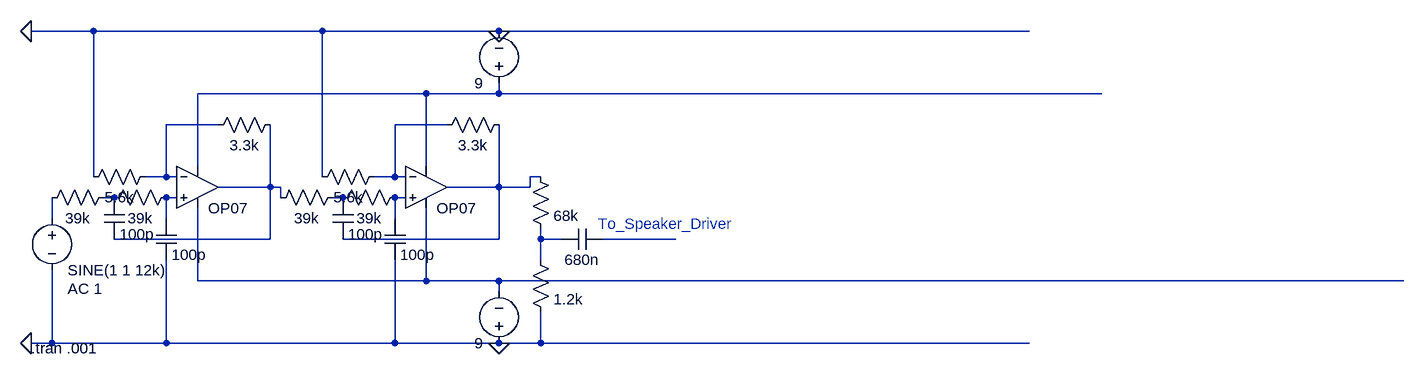
[diagram p0: schematic Transmit_Line_Final.asc]
Transmit_Line_Final.asc, the LTspice schematic file:
Version 4
SHEET 1 1620 680
WIRE -400 -80 -496 -80
WIRE -48 -80 -400 -80
WIRE 224 -80 -48 -80
WIRE 1040 -80 224 -80
WIRE 112 16 -240 16
WIRE 224 16 224 0
WIRE 224 16 112 16
WIRE 1152 16 224 16
WIRE -208 64 -288 64
WIRE 144 64 64 64
WIRE -240 128 -240 16
WIRE 112 128 112 16
WIRE -400 144 -400 -80
WIRE -288 144 -288 64
WIRE -288 144 -320 144
WIRE -272 144 -288 144
WIRE -48 144 -48 -80
WIRE 64 144 64 64
WIRE 64 144 32 144
WIRE 80 144 64 144
WIRE 288 144 272 144
WIRE -128 160 -128 64
WIRE -128 160 -208 160
WIRE -112 160 -128 160
WIRE 224 160 224 64
WIRE 224 160 144 160
WIRE 272 160 272 144
WIRE 272 160 224 160
WIRE -368 176 -384 176
WIRE -272 176 -288 176
WIRE -112 176 -112 160
WIRE -16 176 -32 176
WIRE 80 176 64 176
WIRE -464 208 -464 176
WIRE -288 208 -288 176
WIRE 64 208 64 176
WIRE -128 240 -128 160
WIRE -128 240 -368 240
WIRE 224 240 224 160
WIRE 224 240 -16 240
WIRE 288 240 288 224
WIRE 320 240 288 240
WIRE 496 240 384 240
WIRE 288 272 288 240
WIRE -240 304 -240 192
WIRE 112 304 112 192
WIRE 112 304 -240 304
WIRE 224 304 112 304
WIRE 1616 304 224 304
WIRE 224 320 224 304
WIRE -464 400 -464 288
WIRE -464 400 -496 400
WIRE -288 400 -288 272
WIRE -288 400 -464 400
WIRE 64 400 64 272
WIRE 64 400 -288 400
WIRE 224 400 64 400
WIRE 288 400 288 352
WIRE 288 400 224 400
WIRE 1040 400 288 400
FLAG 224 400 0
FLAG 224 -80 0
FLAG -496 -80 0
FLAG -496 400 0
SYMBOL voltage 224 16 R180
WINDOW 0 24 96 Invisible 2
WINDOW 3 24 16 Left 2
WINDOW 123 0 0 Left 2
WINDOW 39 0 0 Left 2
SYMATTR InstName V1
SYMATTR Value 9
SYMBOL voltage 224 416 R180
WINDOW 0 24 96 Invisible 2
WINDOW 3 24 16 Left 2
WINDOW 123 0 0 Left 2
WINDOW 39 0 0 Left 2
SYMATTR InstName V2
SYMATTR Value 9
SYMBOL Opamps\\OP07 -240 96 R0
WINDOW 0 16 32 Invisible 2
SYMATTR InstName U1
SYMBOL res -304 128 R90
WINDOW 0 0 56 Invisible 2
WINDOW 3 32 56 VTop 2
SYMATTR InstName R1
SYMATTR Value 5.6k
SYMBOL res -112 48 R90
WINDOW 0 0 56 Invisible 2
WINDOW 3 32 56 VTop 2
SYMATTR InstName R2
SYMATTR Value 3.3k
SYMBOL voltage -464 192 R0
WINDOW 0 24 16 Invisible 2
WINDOW 123 24 124 Left 2
WINDOW 39 0 0 Left 2
SYMATTR InstName V3
SYMATTR Value2 AC 1
SYMATTR Value SINE(1 1 12k)
SYMBOL res -368 160 R90
WINDOW 0 0 56 Invisible 2
WINDOW 3 32 56 VTop 2
SYMATTR InstName R5
SYMATTR Value 39k
SYMBOL res -272 160 R90
WINDOW 0 0 56 Invisible 2
WINDOW 3 32 56 VTop 2
SYMATTR InstName R6
SYMATTR Value 39k
SYMBOL cap -304 208 R0
WINDOW 0 24 8 Invisible 2
SYMATTR InstName C1
SYMATTR Value 100p
SYMBOL cap -384 176 R0
WINDOW 0 24 8 Invisible 2
SYMATTR InstName C2
SYMATTR Value 100p
SYMBOL Opamps\\OP07 112 96 R0
WINDOW 0 16 32 Invisible 2
SYMATTR InstName U2
SYMBOL res 48 128 R90
WINDOW 0 0 56 Invisible 2
WINDOW 3 32 56 VTop 2
SYMATTR InstName R3
SYMATTR Value 5.6k
SYMBOL res 240 48 R90
WINDOW 0 0 56 Invisible 2
WINDOW 3 32 56 VTop 2
SYMATTR InstName R4
SYMATTR Value 3.3k
SYMBOL res -16 160 R90
WINDOW 0 0 56 Invisible 2
WINDOW 3 32 56 VTop 2
SYMATTR InstName R7
SYMATTR Value 39k
SYMBOL res 80 160 R90
WINDOW 0 0 56 Invisible 2
WINDOW 3 32 56 VTop 2
SYMATTR InstName R8
SYMATTR Value 39k
SYMBOL cap 48 208 R0
WINDOW 0 24 8 Invisible 2
SYMATTR InstName C3
SYMATTR Value 100p
SYMBOL cap -32 176 R0
WINDOW 0 24 8 Invisible 2
SYMATTR InstName C4
SYMATTR Value 100p
SYMBOL cap 320 224 M90
WINDOW 0 0 32 Invisible 2
WINDOW 3 32 32 VTop 2
SYMATTR InstName C5
SYMATTR Value 680n
SYMBOL res 272 128 R0
WINDOW 0 36 40 Invisible 2
SYMATTR InstName R9
SYMATTR Value 68k
SYMBOL res 272 256 R0
WINDOW 0 36 40 Invisible 2
SYMATTR InstName R10
SYMATTR Value 1.2k
TEXT -496 408 Left 2 !.tran .001
TEXT 376 216 Left 2 ;To_Speaker_Driver

The netlist it stands for:
* Transmit_Line_Final.asc
V1 N001 0 9
V2 0 N013 9
XU1 N007 N002 N001 N013 N005 LT1001  ; OP07, pins In+ In- V+ V- OUT
R1 N002 0 5.6k
R2 N005 N002 3.3k
V3 N010 0 SINE(1 1 12k) AC 1
R5 N006 N010 39k
R6 N007 N006 39k
C1 N007 0 100p
C2 N006 N005 100p
XU2 N009 N003 N001 N013 N004 LT1001  ; OP07, pins In+ In- V+ V- OUT
R3 N003 0 5.6k
R4 N004 N003 3.3k
R7 N008 N005 39k
R8 N009 N008 39k
C3 N009 0 100p
C4 N008 N004 100p
C5 N011 N012 680n
R9 N004 N011 68k
R10 N011 0 1.2k
.tran .001
* To_Speaker_Driver
.lib LTC.lib
.backanno
.end